# EAGLE design Pressure (EAGLE 7.2.0)
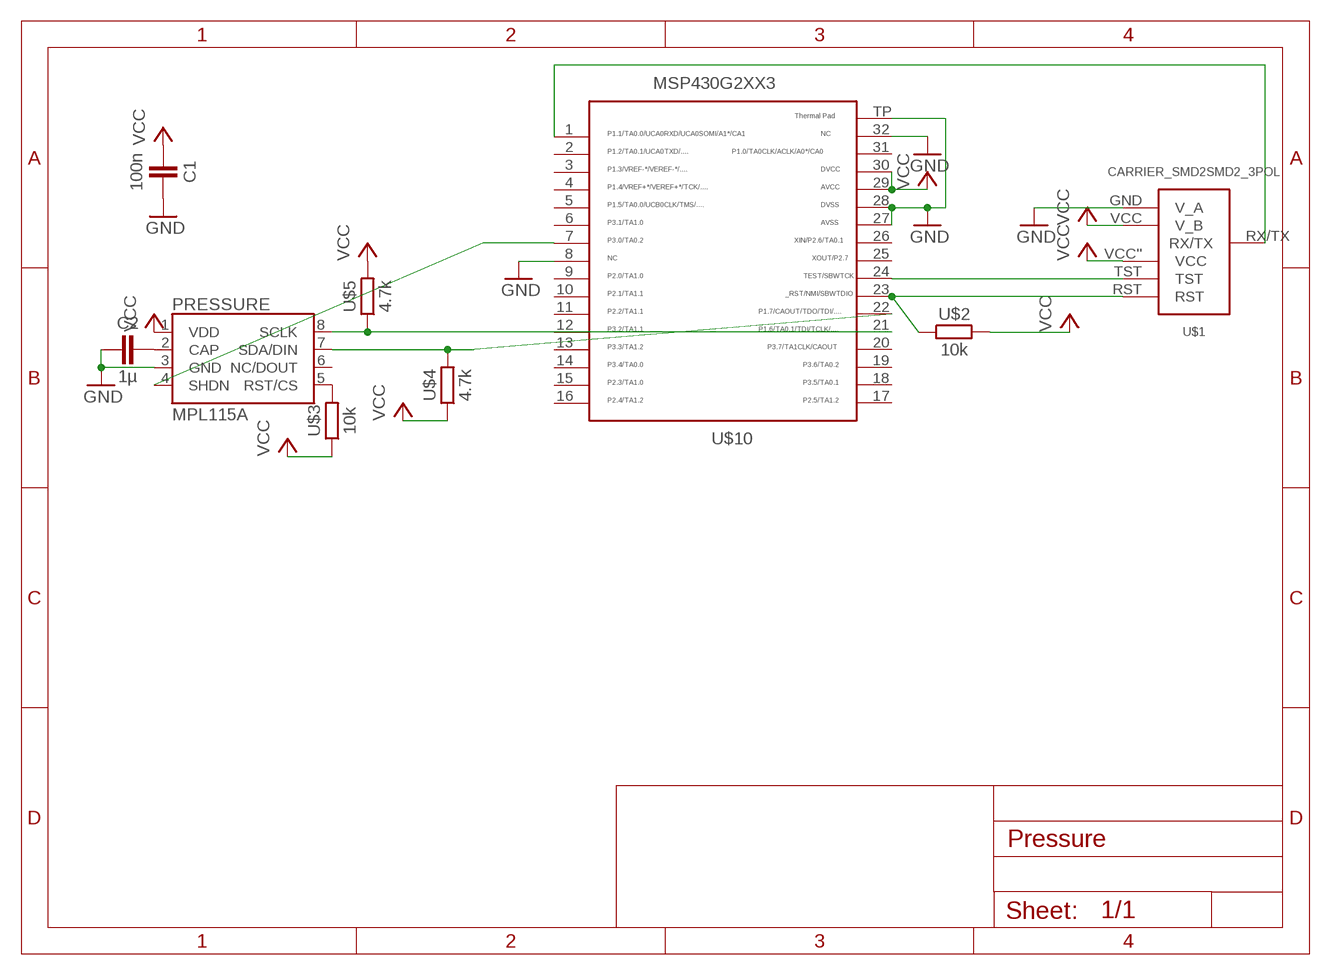
[diagram p0: schematic, sheet 1]

## Parts
C1  100n  CAPACITOR  [603]
C2  1µ  CAPACITOR  [603]
PRESSURE  MPL115A  [LGA8]
U$1  CARRIER_SMD2SMD2_3POL  [CARRIER_SMD2_3POL]
U$2  10k  RESISTOR0603  [603]
U$3  10k  RESISTOR0603  [603]
U$4  4.7k  RESISTOR0603  [603]
U$5  4.7k  RESISTOR0603  [603]
U$10  MSP430G2553  [QFN32]

## Nets
GND: C1.2 C2.1 PRESSURE.3(GND) U$1.GND(V_A) U$10.8 U$10.27 U$10.28 U$10.32 U$10.TP
N$2: PRESSURE.8(SCLK) U$5.1 U$10.21
N$3: U$1.TST U$10.24
N$4: U$1.RST U$2.1 U$10.23
N$5: PRESSURE.7(SDA/DIN) U$4.2 U$10.22
N$6: PRESSURE.4(SHDN) U$10.7
N$7: PRESSURE.5(RST/CS) U$3.2
N$12: U$1.RX/TX U$10.1
N$13: C2.2 PRESSURE.2(CAP)
VCC: C1.1 PRESSURE.1(VDD) U$1.VCC''(VCC) U$1.VCC(V_B) U$2.2 U$3.1 U$4.1 U$5.2 U$10.29 U$10.30
Unconnected: PRESSURE.6(NC/DOUT) U$10.2 U$10.3 U$10.4 U$10.5 U$10.6 U$10.9 U$10.10 U$10.11 U$10.12 U$10.13 U$10.14 U$10.15 U$10.16 U$10.17 U$10.18 U$10.19 U$10.20 U$10.25 U$10.26 U$10.31

## Library data of the parts
C1 C2 = thar:CAPACITOR
PRESSURE = SparkFun-Sensors:MPL115A: MPL115A1 (SPI) and MPL115A2 (I2C) Miniature Digital Barometer 5.0x3.0x1.2mm LGA Package
U$1 = thar:CARRIER_SMD2
U$2-U$5 = thar:RESISTOR
U$10 = thar:MSP430G2553: TEXAS INSTRUMENTS MSP430G2553IRHB32R MCU, 16BIT, MSP430, 16MHZ, QFN-32 Farnell Best.Nr.: 2325726 Herst.Bez.: MSP430G2553IRHB32R

## Board
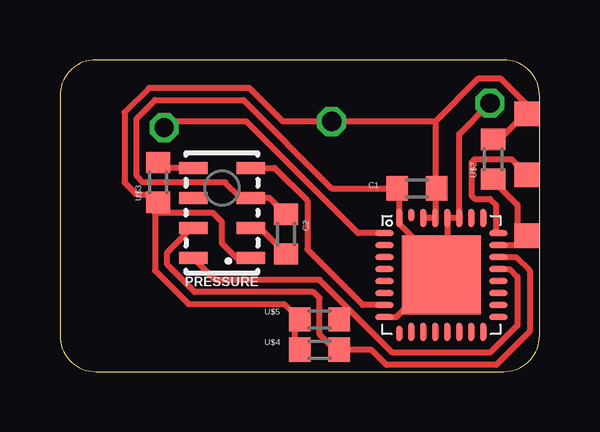
[diagram p1: board, top side]
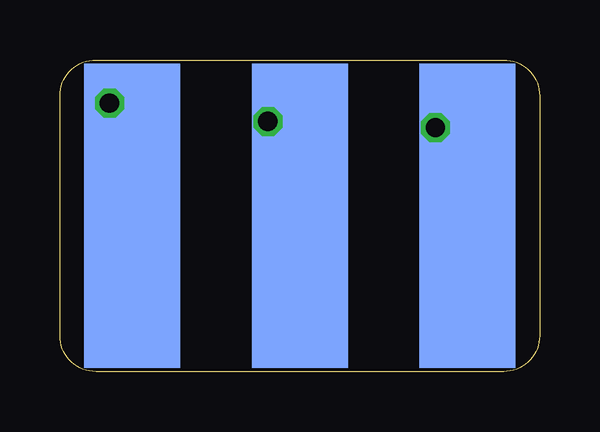
[diagram p2: board, bottom side, seen from below]

Size 20 x 13 mm. Coordinates in mm from the lower left corner, seen from the top.
Copper layers (1*16): Top 0.035mm / dielectric 1.5mm / Bottom 0.035mm
Design rules "Bilex DRU *": minimum track width 10mil, minimum drill 24mil, track to track 10mil, track to pad 10mil, pad to pad 10mil, via to via 10mil, smd to smd 10mil, copper to edge 1mil, drill to drill 8mil, minimum pad ring 10mil, minimum via ring 8mil, stop-mask expansion 4mil, vias tented up to drill 0mil, thermal gap 10mil

### Footprints (pad centres in the part's own frame; a part is rotated, then mirrored left to right if it is on the bottom)
603 = smd 0.889 x 1.016: 1 -0.826,0; 2 0.826,0
LGA8 = smd 1.2 x 0.5: 1 -1.2,1.875; 2 -1.2,0.625; 3 -1.2,-0.625; 4 -1.2,-1.875; 5 1.2,-1.875; 6 1.2,-0.625; 7 1.2,0.625; 8 1.2,1.875
CARRIER_SMD2_3POL = smd 4 x 12.7 bottom: GND -6.985,0; RX/TX 6.985,0; VCC 0,0 | smd 1.016 x 1.016: RST -9.461,0.826; TST -9.461,-1.714; VCC'' -9.461,-4.255
QFN32 = smd 0.762 x 0.254: 1 -2.375,1.75; 2 -2.375,1.25; 3 -2.375,0.75; 4 -2.375,0.25; 5 -2.375,-0.25; 6 -2.375,-0.75; 7 -2.375,-1.25; 8 -2.375,-1.75; 17 2.375,-1.75; 18 2.375,-1.25; 19 2.375,-0.75; 20 2.375,-0.25; 21 2.375,0.25; 22 2.375,0.75; 23 2.375,1.25; 24 2.375,1.75 | smd 0.254 x 0.635: 9 -1.75,-2.438 | smd 0.254 x 0.762: 10 -1.25,-2.375; 11 -0.75,-2.375; 12 -0.25,-2.375; 13 0.25,-2.375; 14 0.75,-2.375; 15 1.25,-2.375; 16 1.75,-2.375; 25 1.75,2.375; 26 1.25,2.375; 27 0.75,2.375; 28 0.25,2.375; 29 -0.25,2.375; 30 -0.75,2.375; 32 -1.75,2.375 | smd 0.254 x 0.508: 31 -1.25,2.5 | smd 3.302 x 3.302: TP 0,0

### Placement (x,y rotation side)
C1  14.89,7.64 180 top
C2  9.43,5.74 270 top
PRESSURE  6.76,6.62 180 top
U$1  10,6.5 180 top
U$2  18.06,8.86 90 top
U$3  4.09,7.89 90 top
U$4  10.82,0.91 0 top
U$5  10.82,2.18 180 top
U$10  15.9,4.03 0 top

### Tracks (layer width: path | path; a pad name or v marks a point on that pad's centre or on a via)
GND  (via drill 0.8)
  Top 0.254: 16.43,4.35 16.19,5.38 16.16,5.35 | 16.43,4.35 16.48,3.06 U$10.TP 15.01,2.94 14.89,3.14 14.03,2.28 U$10.8 | C1.2 14.18,7.64 14.15,7.49 U$10.32 14.15,6.16 14.76,5.55 15.52,5.35 16.15,4.72 | 13.93,7.64 C1.2 | 16.15,4.72 U$10.28 U$10.27 16.65,9.91 v17.93,11.2 | 16.15,4.72 16.15,4.42 16.43,4.35 | 7.52,7.26 7.53,7.25 PRESSURE.3 | 7.52,7.26 6.89,7.89 3.46,7.89 3.2,8.15 3.2,10.56 3.96,11.32 7.65,11.32 11.33,7.64 C1.2 | 7.52,7.26 8.73,7.26 C2.1
  Bottom 0.254: 18,6.5 17.68,6.82 17.68,7.39 17.93,7.64 v17.93,11.2 16.98,10.25 U$1.GND
N$2
  Top 0.254: U$10.21 18.75,4.28 19.08,3.96 19.08,1.92 17.93,0.78 13.87,0.78 12.09,2.56 | U$5.1 11.78,2.24 12.09,2.56 | 12.09,2.56 10.82,3.83 6.48,3.83 PRESSURE.8
N$3
  Top 0.254: 19.61,7.88 19.46,8.02 19.5,8.18 U$1.TST | U$10.24 18.19,5.78 18.19,6.95 17.93,7.21 17.3,7.21 17.17,7.33 17.17,8.73 17.3,8.86 18.82,8.86 19.24,8.44 U$1.TST | U$1.TST
N$4
  Top 0.254: 19.46,5.48 19.5,5.38 | 19.46,5.48 19.5,5.69 | 19.5,5.69 19.08,5.74 19.08,6.95 18.06,7.97 U$2.1 | U$10.23 19.28,5.28 19.46,5.48 | 19.5,5.69 19.48,5.69 U$1.RST
N$5
  Top 0.254: U$10.22 19.02,4.78 19.59,4.21 19.59,1.67 18.19,0.27 13.62,0.27 12.98,0.91 U$4.2 11.59,0.78 10.82,1.54 10.82,3.07 10.57,3.32 5.62,3.32 4.47,4.46 4.47,4.97 5.49,5.99 PRESSURE.7
N$6
  Top 0.254: U$10.7 12.63,2.78 10.7,4.72 10.31,5.1 10.31,7.13 8.95,8.5 PRESSURE.4
N$7
  Top 0.254: PRESSURE.5 4.31,8.5 U$3.2
N$12  (via drill 0.8)
  Top 0.254: U$10.1 12.43,5.78 7.78,10.43 4.35,10.43 v4.35,10.18
  Bottom 0.254: U$1.RX/TX 3.01,9.22 v4.35,10.18
N$13
  Top 0.254: PRESSURE.2 8.34,6 C2.2
VCC  (via drill 0.8)
  Top 0.254: U$10.29 | 15.65,10.43 15.65,8.02 | 15.65,8.02 U$10.29 | 15.78,7.77 15.71,8.02 | 15.71,8.02 15.65,8.02 | U$10.29 U$10.30 | C1.1 15.71,8.02 | 19.5,10.52 19.46,10.56 | U$2.2 18.12,9.48 19.2,10.56 19.2,10.51 19.46,10.56 | 19.59,10.69 19.65,10.75 19.65,10.95 18.39,12.21 17.43,12.21 15.65,10.43 | 19.59,10.69 19.46,10.56 | U$4.1 9.81,0.91 9.81,1.8 | 9.81,1.8 9.81,1.86 U$5.2 | U$5.2 10,1.99 9.81,1.8 | PRESSURE.1 7.36,4.75 6.76,5.35 6.76,6.24 6.38,6.62 4.09,6.62 | 4.09,6.62 3.96,6.62 3.96,4.21 5.36,2.81 9.36,2.81 U$5.2 | U$3.1 4.09,6.62 | 15.65,10.43 v11.33,10.43 9.3,10.43 7.9,11.83 3.71,11.83 2.7,10.81 2.7,7.89 3.2,7.39 3.77,7.39 U$3.1 | 3.96,6.75 3.96,6.94 U$3.1 | U$1.VCC'' 19.52,10.76 19.59,10.69
  Bottom 0.254: U$1.VCC 10,9.99 v11.33,10.43